# EAGLE design W002X (EAGLE 6.6.0)
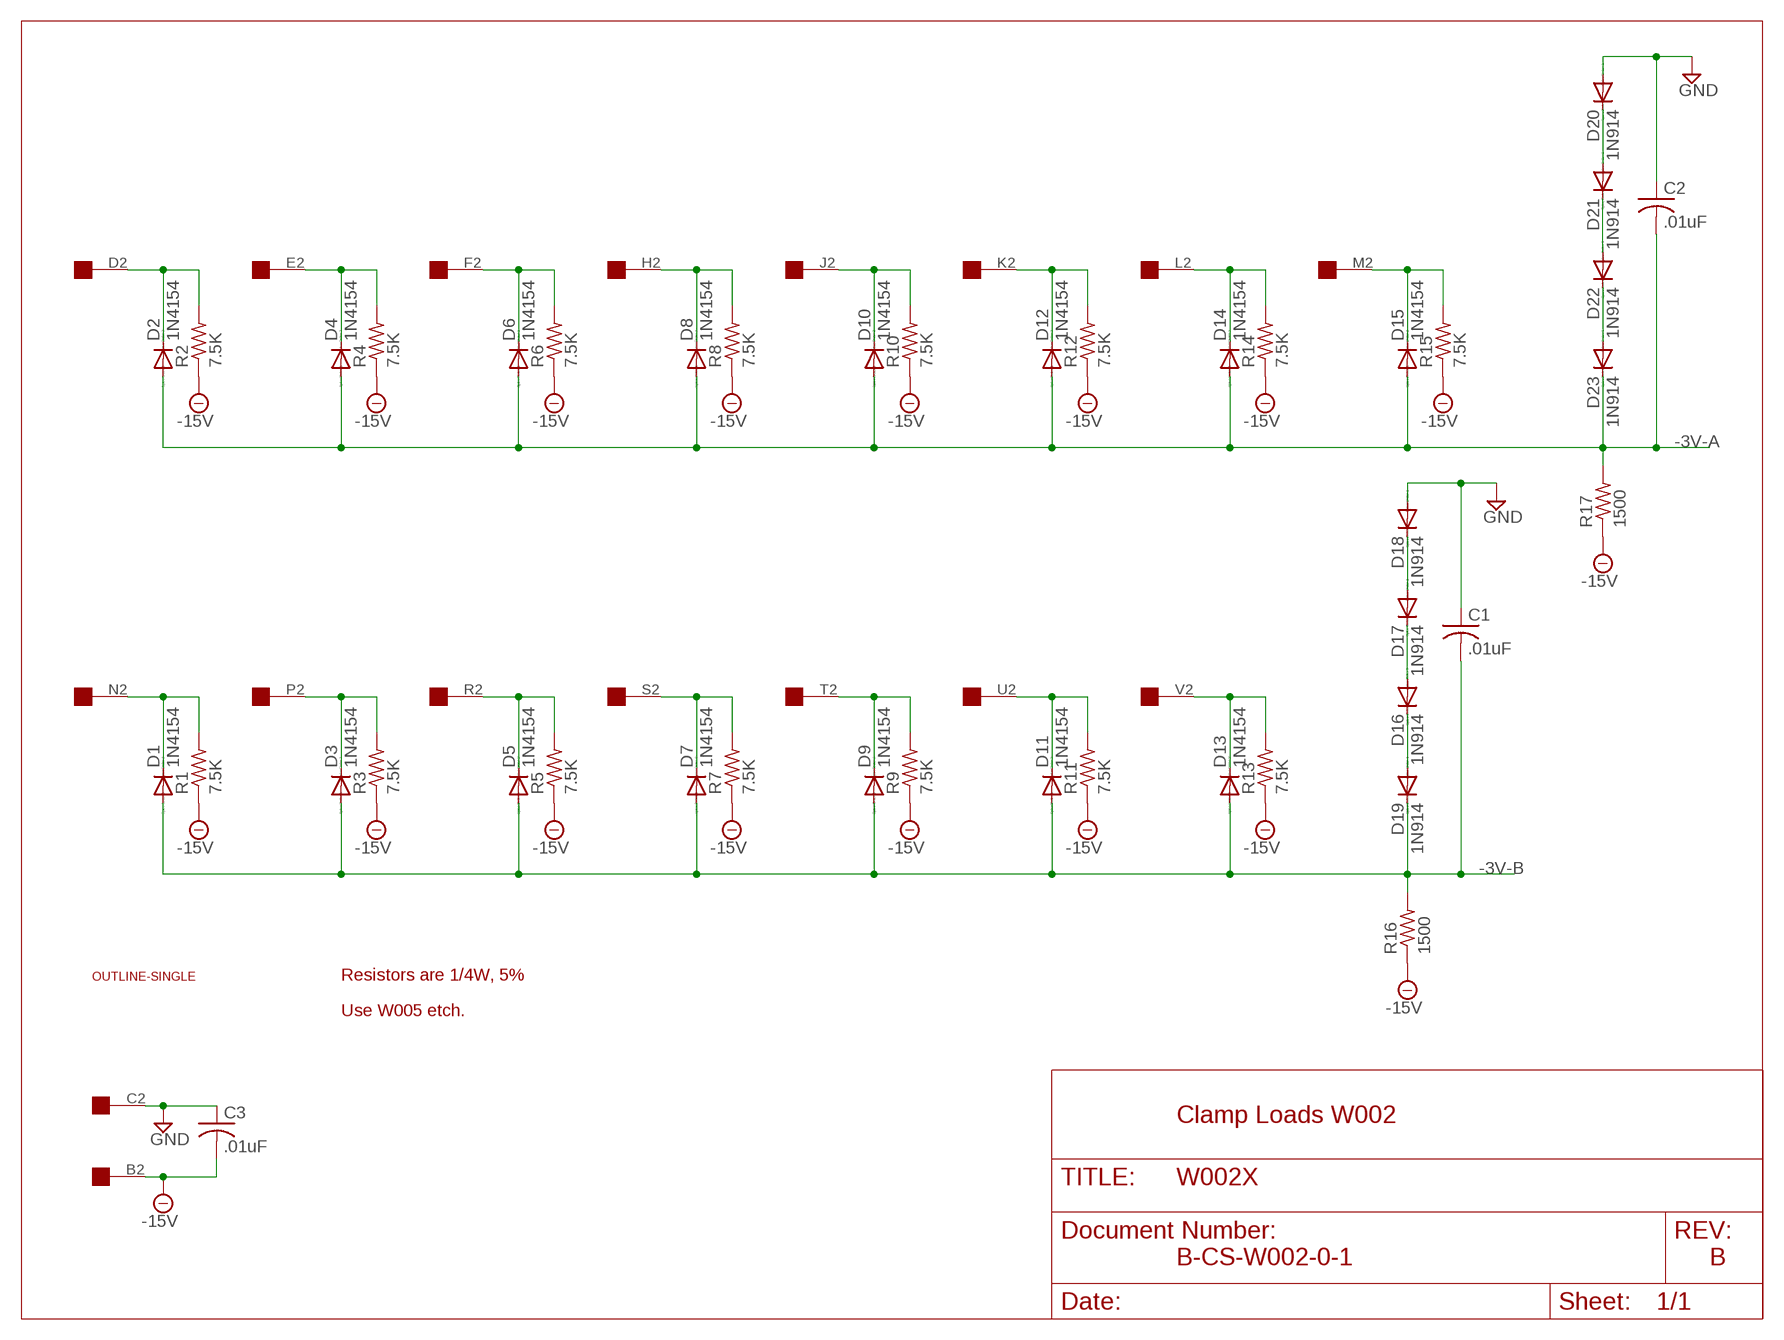
[diagram p0: schematic, sheet 1]

## Parts
C1  .01uF  C-US050-025X075  [C050-025X075]
C2  .01uF  C-US050-025X075  [C050-025X075]
C3  .01uF  C-US050-025X075  [C050-025X075]
D1  1N4154  1N4148DO35-10  [DO35-10]
D2  1N4154  1N4148DO35-10  [DO35-10]
D3  1N4154  1N4148DO35-10  [DO35-10]
D4  1N4154  1N4148DO35-10  [DO35-10]
D5  1N4154  1N4148DO35-10  [DO35-10]
D6  1N4154  1N4148DO35-10  [DO35-10]
D7  1N4154  1N4148DO35-10  [DO35-10]
D8  1N4154  1N4148DO35-10  [DO35-10]
D9  1N4154  1N4148DO35-10  [DO35-10]
D10  1N4154  1N4148DO35-10  [DO35-10]
D11  1N4154  1N4148DO35-10  [DO35-10]
D12  1N4154  1N4148DO35-10  [DO35-10]
D13  1N4154  1N4148DO35-10  [DO35-10]
D14  1N4154  1N4148DO35-10  [DO35-10]
D15  1N4154  1N4148DO35-10  [DO35-10]
D16  1N914  1N4148DO35-10  [DO35-10]
D17  1N914  1N4148DO35-10  [DO35-10]
D18  1N914  1N4148DO35-10  [DO35-10]
D19  1N914  1N4148DO35-10  [DO35-10]
D20  1N914  1N4148DO35-10  [DO35-10]
D21  1N914  1N4148DO35-10  [DO35-10]
D22  1N914  1N4148DO35-10  [DO35-10]
D23  1N914  1N4148DO35-10  [DO35-10]
R1  7.5K  R-US_0207/10  [0207/10]
R2  7.5K  R-US_0207/10  [0207/10]
R3  7.5K  R-US_0207/10  [0207/10]
R4  7.5K  R-US_0207/10  [0207/10]
R5  7.5K  R-US_0207/10  [0207/10]
R6  7.5K  R-US_0207/10  [0207/10]
R7  7.5K  R-US_0207/10  [0207/10]
R8  7.5K  R-US_0207/10  [0207/10]
R9  7.5K  R-US_0207/10  [0207/10]
R10  7.5K  R-US_0207/10  [0207/10]
R11  7.5K  R-US_0207/10  [0207/10]
R12  7.5K  R-US_0207/10  [0207/10]
R13  7.5K  R-US_0207/10  [0207/10]
R14  7.5K  R-US_0207/10  [0207/10]
R15  7.5K  R-US_0207/10  [0207/10]
R16  1500  R-US_0207/10  [0207/10]
R17  1500  R-US_0207/10  [0207/10]
U$1  OUTLINE-SINGLE  [SINGLE]
U$2  EDGE-1  [EDGE-CON1]

## Nets
-3V-A [Supply]: C2.2 D2.A D4.A D6.A D8.A D10.A D12.A D14.A D15.A D23.C R17.2
-3V-B [Supply]: C1.2 D1.A D3.A D5.A D7.A D9.A D11.A D13.A D19.C R16.2
-15V [Supply]: C3.2 R1.1 R2.1 R3.1 R4.1 R5.1 R6.1 R7.1 R8.1 R9.1 R10.1 R11.1 R12.1 R13.1 R14.1 R15.1 R16.1 R17.1 U$2.B2
GND [Supply]: C1.1 C2.1 C3.1 D18.A D20.A U$2.C2
N$1: D22.C D23.A
N$2: D2.C R2.2 U$2.D2
N$3: D4.C R4.2 U$2.E2
N$4: D1.C R1.2 U$2.N2
N$5: D3.C R3.2 U$2.P2
N$6: D5.C R5.2 U$2.R2
N$7: D6.C R6.2 U$2.F2
N$8: D7.C R7.2 U$2.S2
N$9: D8.C R8.2 U$2.H2
N$10: D9.C R9.2 U$2.T2
N$11: D10.C R10.2 U$2.J2
N$12: D11.C R11.2 U$2.U2
N$13: D12.C R12.2 U$2.K2
N$14: D13.C R13.2 U$2.V2
N$15: D14.C R14.2 U$2.L2
N$16: D15.C R15.2 U$2.M2
N$17: D17.A D18.C
N$18: D16.A D17.C
N$19: D16.C D19.A
N$27: D20.C D21.A
N$29: D21.C D22.A
Unconnected: U$2.A2

## Notes on the sheet
- Resistors are 1/4W, 5%
- Use W005 etch.
- Clamp Loads W002
- B-CS-W002-0-1 | B

## Library data of the parts
C1-C3 = rcl:C-US: CAPACITOR, American symbol
D1-D23 = diode:1N4148: DIODE high speed (Philips)
R1-R17 = rcl:R-US_: RESISTOR, American symbol
U$1 = dec-con:OUTLINE-*: Board outlines for DEC boards.
U$2 = dec-con:EDGE-1: Single-Sided DEC Edge Connector -- (side 2)

## Net classes
1 Supply: width 0.813 mm

## Board
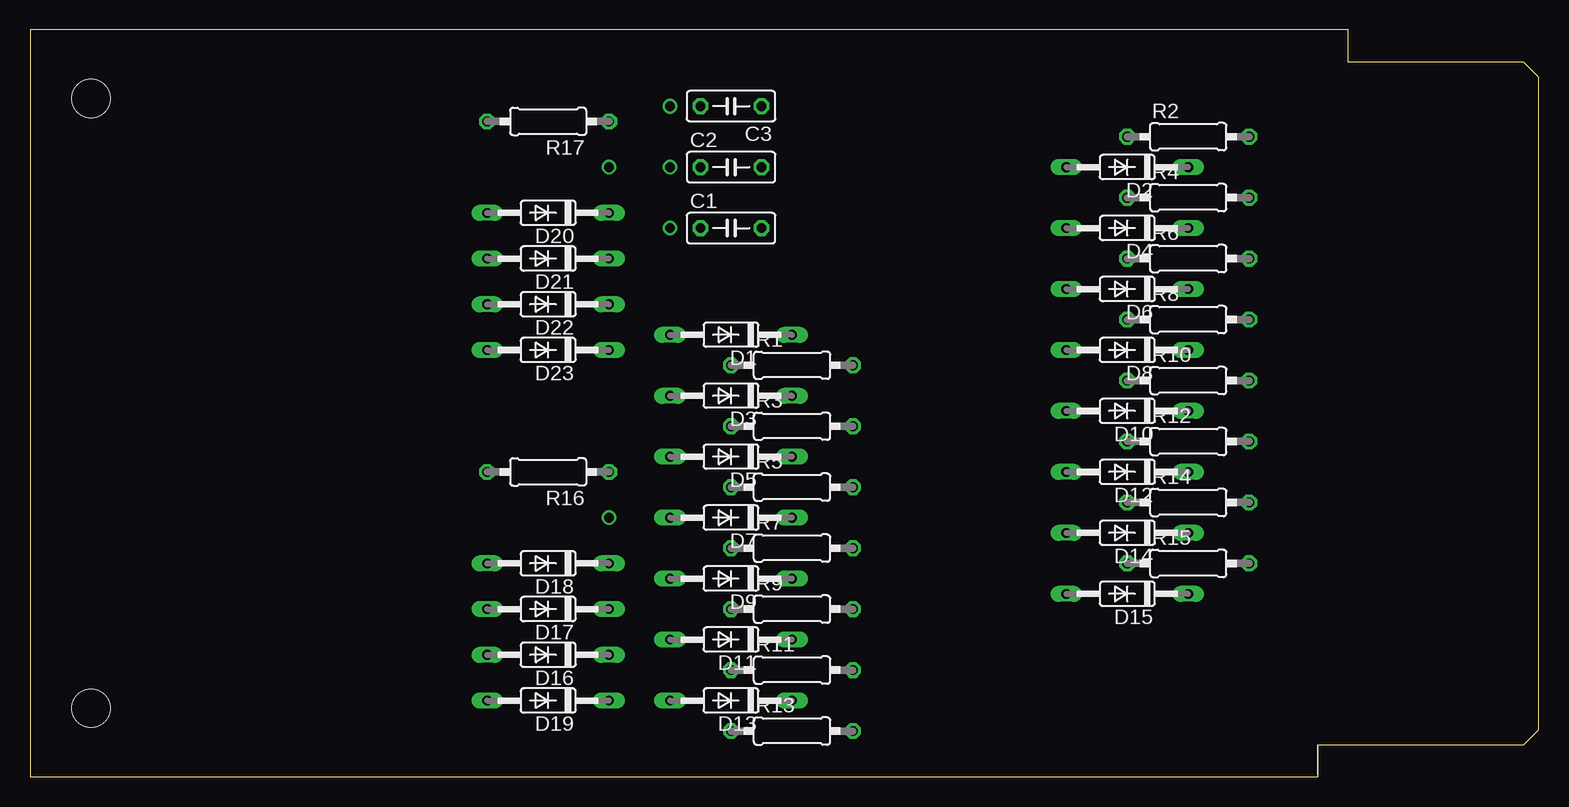
[diagram p1: board, top side]
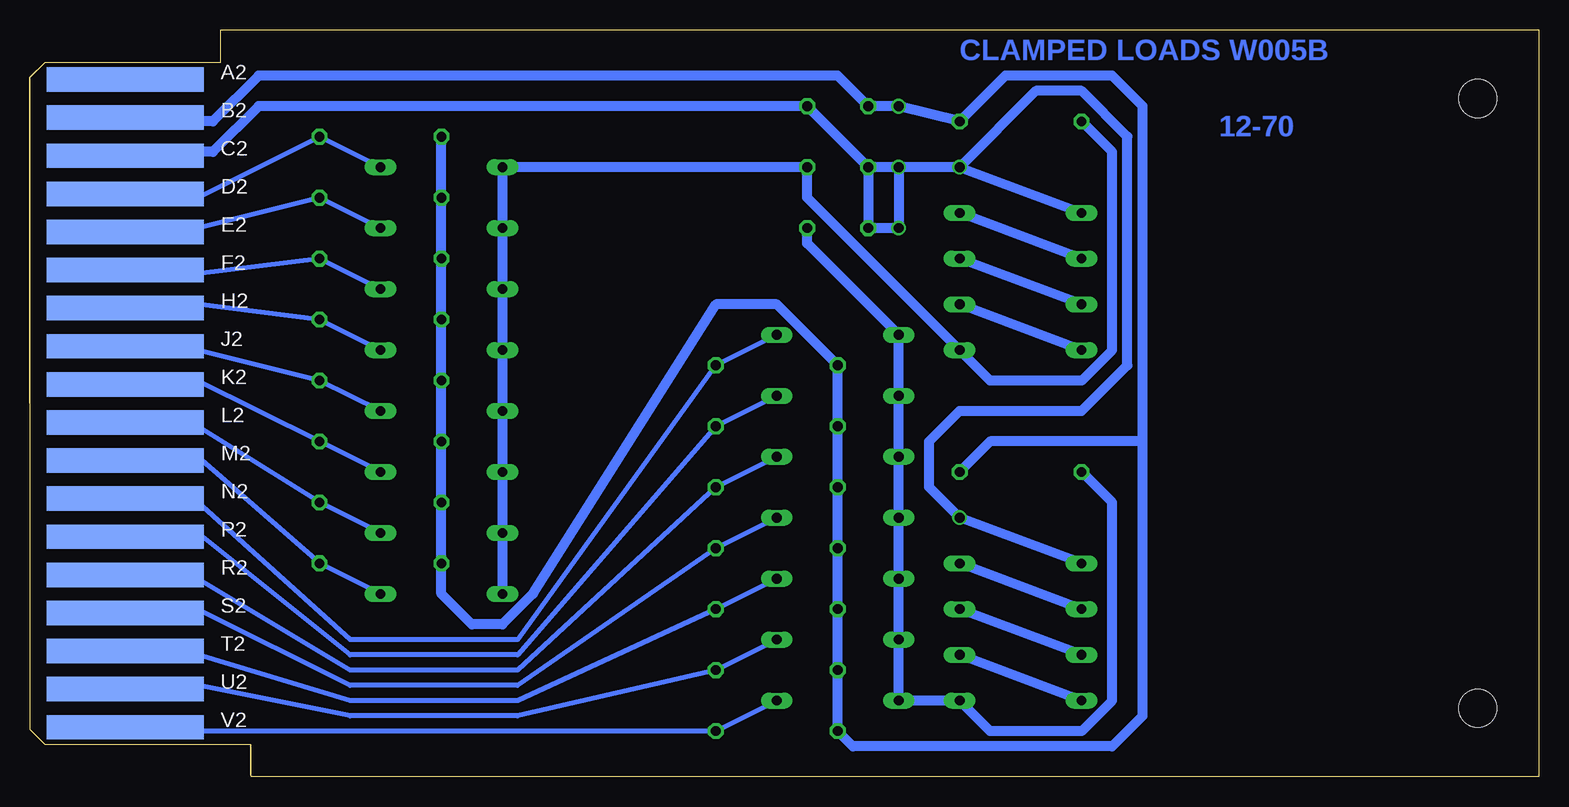
[diagram p2: board, bottom side, seen from below]

Size 125.73 x 62.23 mm. Coordinates in mm from the lower left corner, seen from the top.
Copper layers (1+16): Top 0.035mm / dielectric 1.5mm / Bottom 0.035mm
Design rules "16mils": minimum track width 16mil, minimum drill 32mil, track to track 15mil, track to pad 10mil, pad to pad 10mil, via to via 10mil, smd to smd 10mil, copper to edge 13mil, drill to drill 10mil, minimum pad ring 10mil, minimum via ring 8mil, stop-mask expansion 0mil, vias tented up to drill 0mil, thermal gap 10mil

### Footprints (pad centres in the part's own frame; a part is rotated, then mirrored left to right if it is on the bottom)
C050-025X075 = drill 0.813 octagon: 1 -2.54,0; 2 2.54,0
DO35-10 = drill 0.813 long: A 5.08,0; C -5.08,0
0207/10 = drill 0.813 octagon: 1 -5.08,0; 2 5.08,0
SINGLE = hole 3.175: 120.65,56.515; 120.65,5.715
EDGE-CON1 = smd 13.106 x 2.032 bottom: A2 7.938,4.128; B2 7.938,7.303; C2 7.938,10.477; D2 7.938,13.652; E2 7.938,16.828; F2 7.938,20.003; H2 7.938,23.177; J2 7.938,26.352; K2 7.938,29.527; L2 7.938,32.703; M2 7.938,35.877; N2 7.938,39.053; P2 7.938,42.227; R2 7.938,45.403; S2 7.938,48.578; T2 7.938,51.752; U2 7.938,54.928; V2 7.938,58.102

### Placement (x,y rotation side)
C1  58.42,45.72 0 top
C2  58.42,50.8 0 top
C3  58.42,55.88 180 top
D1  58.42,36.83 180 top
D2  91.44,50.8 180 top
D3  58.42,31.75 180 top
D4  91.44,45.72 180 top
D5  58.42,26.67 180 top
D6  91.44,40.64 180 top
D7  58.42,21.59 180 top
D8  91.44,35.56 180 top
D9  58.42,16.51 180 top
D10  91.44,30.48 180 top
D11  58.42,11.43 180 top
D12  91.44,25.4 180 top
D13  58.42,6.35 180 top
D14  91.44,20.32 180 top
D15  91.44,15.24 180 top
D16  43.18,10.16 180 top
D17  43.18,13.97 180 top
D18  43.18,17.78 180 top
D19  43.18,6.35 180 top
D20  43.18,46.99 180 top
D21  43.18,43.18 180 top
D22  43.18,39.37 180 top
D23  43.18,35.56 180 top
R1  63.5,34.29 0 top
R2  96.52,53.34 0 top
R3  63.5,29.21 0 top
R4  96.52,48.26 0 top
R5  63.5,24.13 0 top
R6  96.52,43.18 0 top
R7  63.5,19.05 0 top
R8  96.52,38.1 0 top
R9  63.5,13.97 0 top
R10  96.52,33.02 0 top
R11  63.5,8.89 0 top
R12  96.52,27.94 0 top
R13  63.5,3.81 0 top
R14  96.52,22.86 0 top
R15  96.52,17.78 0 top
R16  43.18,25.4 180 top
R17  43.18,54.61 180 top
U$1  125.73,62.23 180 top
U$2  125.73,62.23 180 top

### Tracks (layer width: path | path; a pad name or v marks a point on that pad's centre or on a via)
-3V-A
  Bottom 0.813: D15.A D14.A D12.A D10.A D8.A D6.A D4.A D2.A C2.2 60.96,48.26 D23.C 45.72,33.02 38.1,33.02 35.56,35.56 35.56,52.07 R17.2
-3V-B
  Bottom 0.813: C1.2 60.96,44.45 D1.A D3.A D5.A D7.A D9.A D11.A D13.A D19.C 45.72,3.81 38.1,3.81 35.56,6.35 35.56,22.86 R16.2
-15V  (via drill 0.81)
  Bottom 0.813: U$2.B2 116.84,54.9 116.84,54.61 110.49,54.61 106.68,58.42 58.42,58.42 C3.2 v53.34,55.88 R17.1 44.45,58.42 35.56,58.42 33.02,55.88 33.02,27.94 | R2.1 R4.1 R6.1 R8.1 R10.1 R12.1 R14.1 R15.1 91.44,15.24 88.9,12.7 86.36,12.7 83.82,15.24 68.58,39.37 63.5,39.37 R1.1 R3.1 R5.1 R7.1 R9.1 R11.1 R13.1 57.15,2.54 35.56,2.54 33.02,5.08 33.02,27.94 | R16.1 45.72,27.94 33.02,27.94
GND  (via drill 0.81)
  Bottom 0.813: U$2.C2 117.17,51.74 116.84,52.07 110.49,52.07 106.68,55.88 C3.1 C2.1 | v53.34,50.8 v53.34,45.72 C1.1 C2.1 | v53.34,50.8 C2.1 | D18.A v48.26,21.59 50.8,24.13 50.8,27.94 48.26,30.48 38.1,30.48 34.29,34.29 34.29,53.34 38.1,57.15 41.91,57.15 v48.26,50.8 | v48.26,50.8 D20.A | v48.26,50.8 v53.34,50.8
N$1
  Bottom 0.813: D23.A D22.C
N$2
  Bottom 0.406: U$2.D2 117.14,48.56 116.84,48.26 111.76,48.26 R2.2 D2.C
N$3
  Bottom 0.406: U$2.E2 117.17,45.39 116.84,45.72 111.76,45.72 R4.2 D4.C
N$4
  Bottom 0.406: U$2.N2 116.84,22.86 111.76,22.86 99.06,11.43 85.09,11.43 R1.2 D1.C
N$5
  Bottom 0.406: D3.C R3.2 85.09,10.16 99.06,10.16 111.76,20.32 116.84,20.32 116.84,19.99 U$2.P2
N$6
  Bottom 0.406: D5.C R5.2 85.09,8.89 99.06,8.89 111.76,16.51 116.84,16.51 116.84,16.84 U$2.R2
N$7
  Bottom 0.406: U$2.F2 117.12,42.19 116.84,41.91 111.76,41.91 R6.2 D6.C
N$8
  Bottom 0.406: D7.C R7.2 85.09,7.62 99.06,7.62 111.76,13.97 116.84,13.97 116.84,13.66 U$2.S2
N$9
  Bottom 0.406: U$2.H2 117.17,39.04 116.84,39.37 111.76,39.37 R8.2 D8.C
N$10
  Bottom 0.406: D9.C R9.2 85.09,6.35 99.06,6.35 111.76,10.16 116.84,10.16 116.84,10.49 U$2.T2
N$11
  Bottom 0.406: U$2.J2 117.17,35.89 116.84,35.56 111.76,35.56 R10.2 D10.C
N$12
  Bottom 0.406: D11.C R11.2 85.09,5.08 99.06,5.08 111.76,7.62 116.84,7.62 116.84,7.26 U$2.U2
N$13
  Bottom 0.406: U$2.K2 117.14,32.72 116.84,33.02 111.76,33.02 R12.2 D12.C
N$14
  Bottom 0.406: D13.C R13.2 116.84,3.81 117.16,4.13 U$2.V2
N$15
  Bottom 0.406: U$2.L2 117.17,29.54 116.84,29.21 111.76,29.21 R14.2 D14.C
N$16
  Bottom 0.406: U$2.M2 117.17,26.34 116.84,26.67 111.76,26.67 R15.2 D15.C
N$17
  Bottom 0.813: D17.A D18.C
N$18
  Bottom 0.813: D16.A D17.C
N$19
  Bottom 0.813: D19.A D16.C
N$27
  Bottom 0.813: D21.A D20.C
N$29
  Bottom 0.813: D22.A D21.C

### Text on the board
Bottom: CLAMPED LOADS W005B | 12-70